# EAGLE design XYSunConnectors (EAGLE 9.6.2)
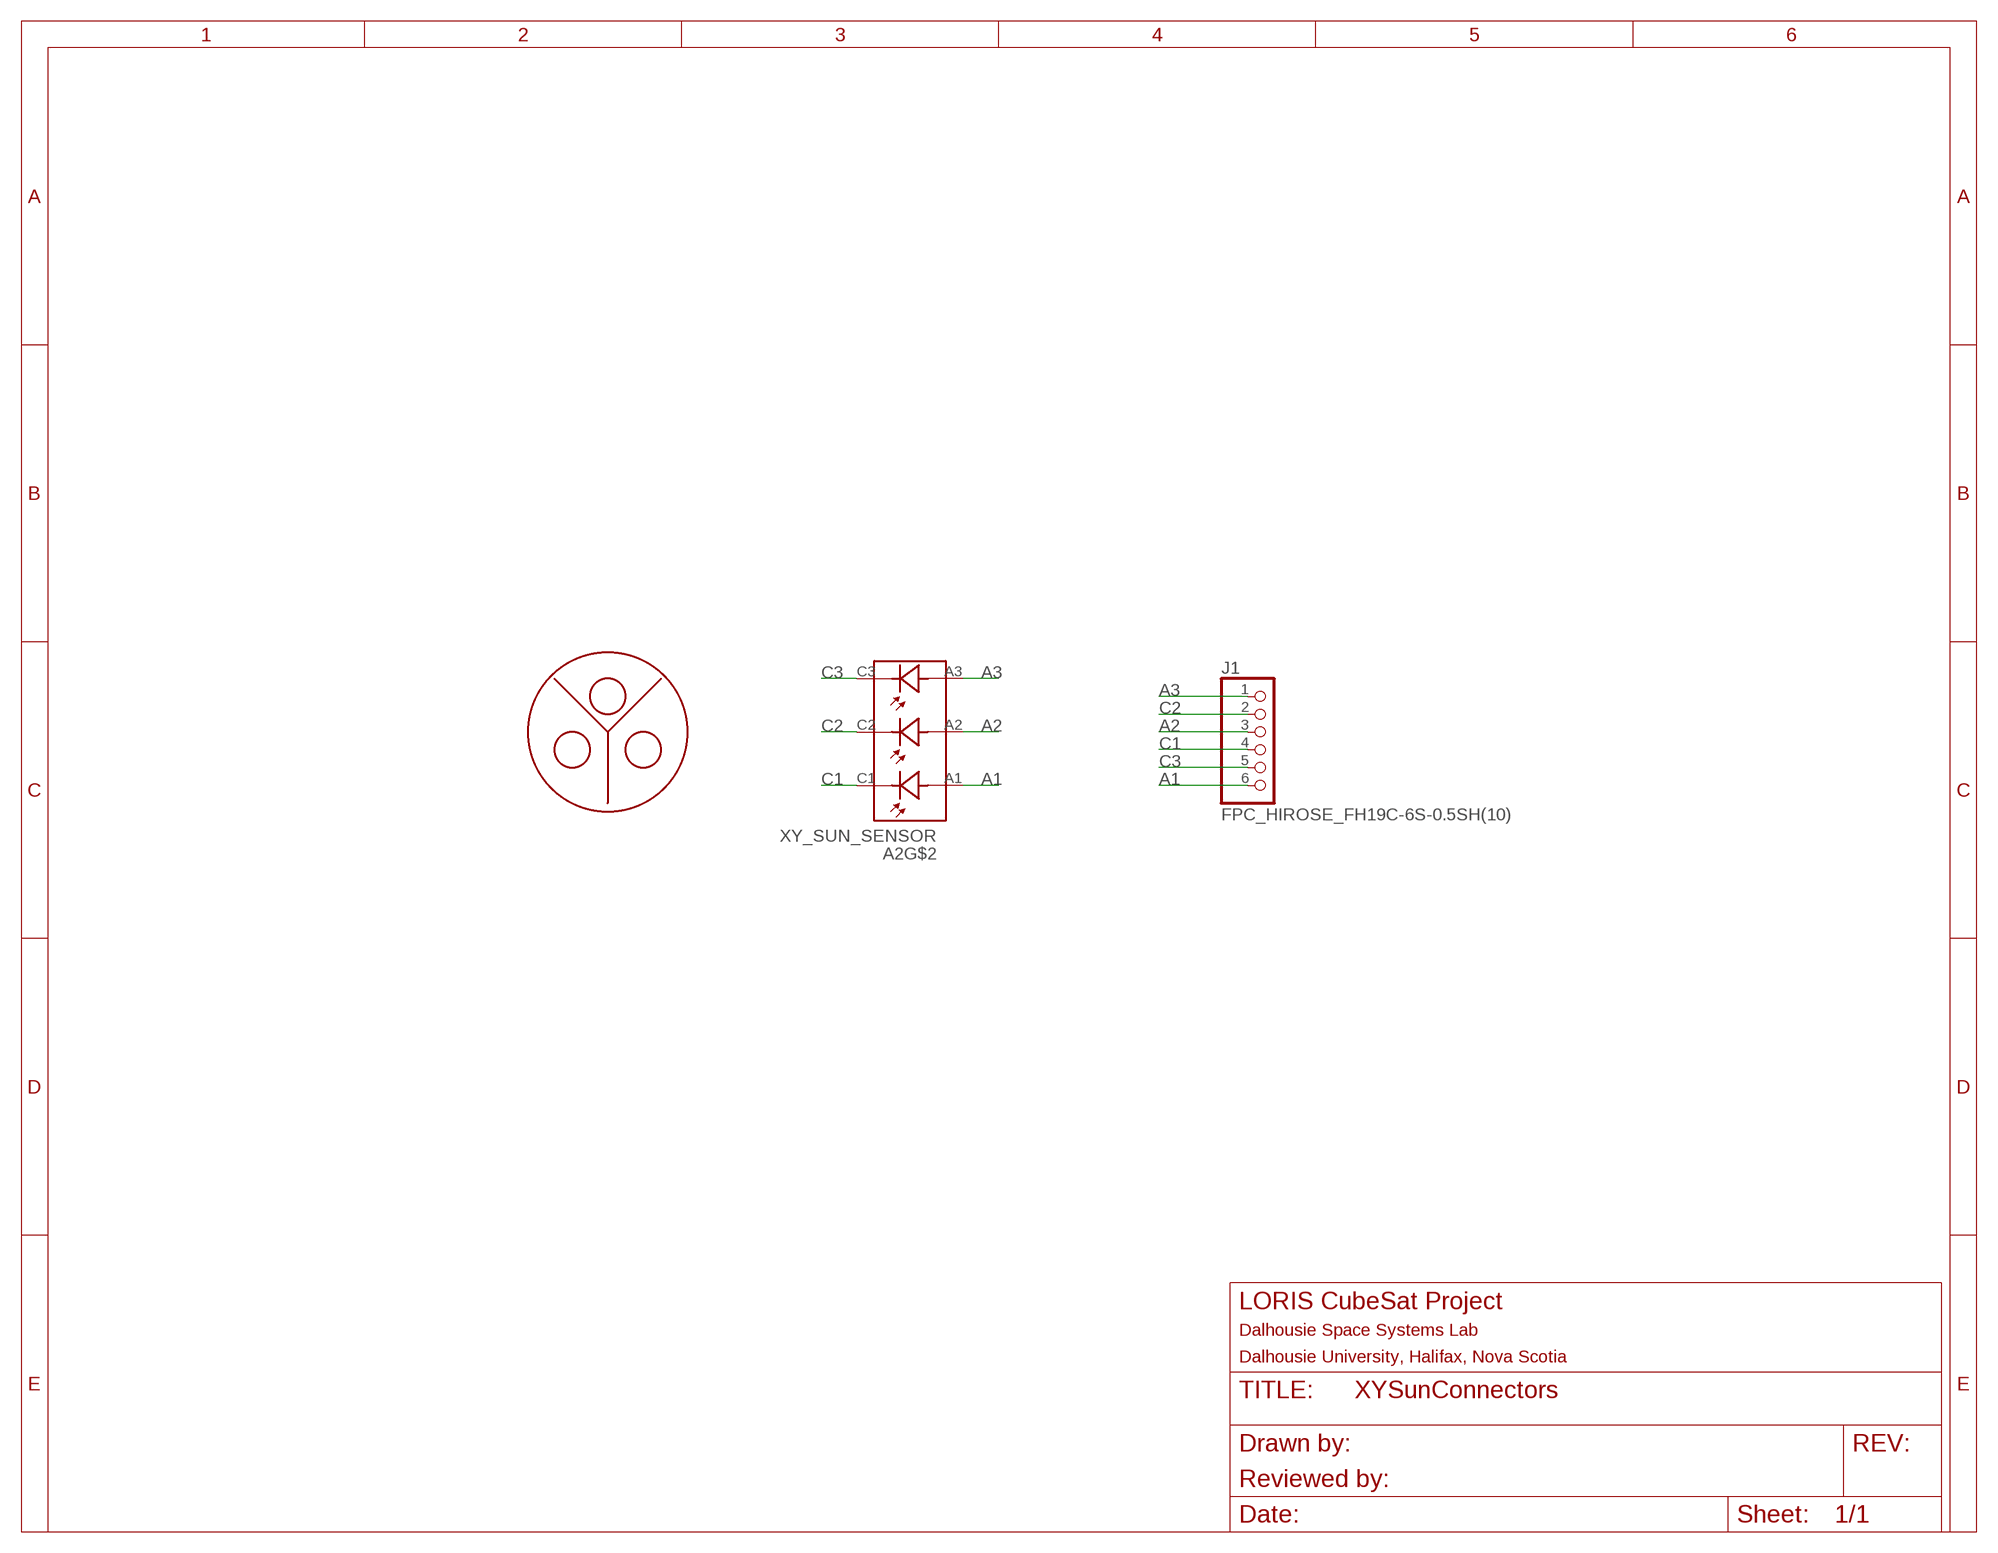
[diagram p0: schematic, sheet 1]

## Parts
A2  XY_SUN_SENSOR  [XY_SUN_SENOR_MASK]
J1  FPC_HIROSE_FH19C-6S-0.5SH(10)  [FPC_HIROSE_FH19C-6S-0.5SH(10)]

## Nets
A1: A2.A1 J1.6
A2: A2.A2 J1.3
A3: A2.A3 J1.1
C1: A2.C1 J1.4
C2: A2.C2 J1.2
C3: A2.C3 J1.5

## Library data of the parts
A2 = my_library:XY_SUN_SENSOR
J1 = my_library:FPC_HIROSE_FH19C-6S-0.5SH(10)

## Board
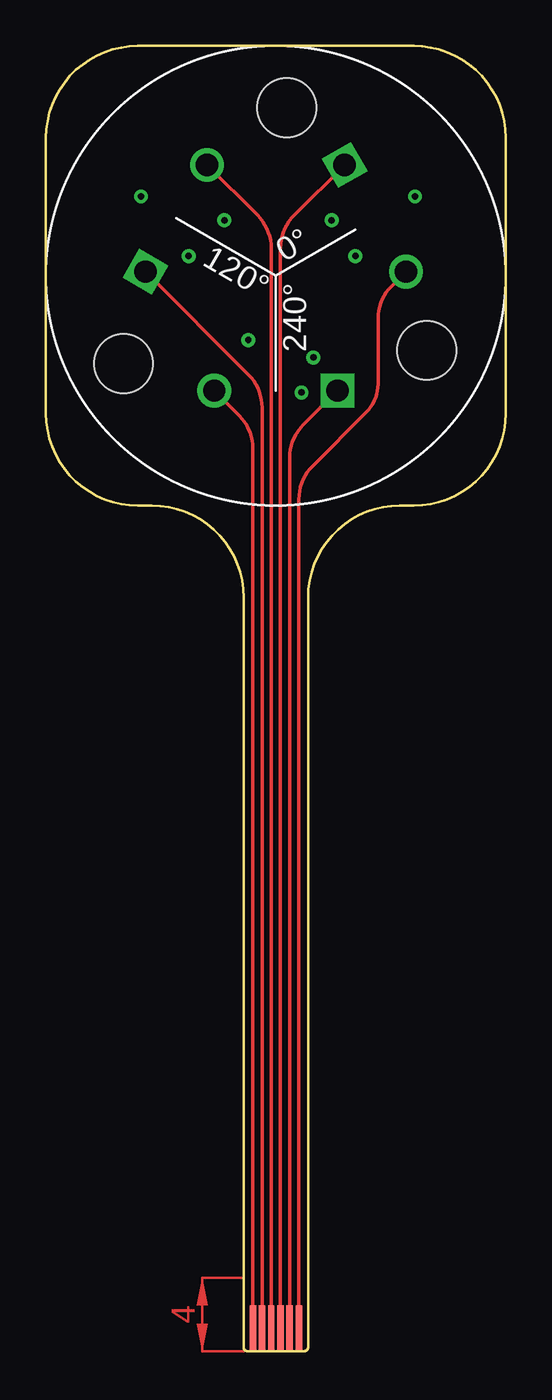
[diagram p1: board, top side]
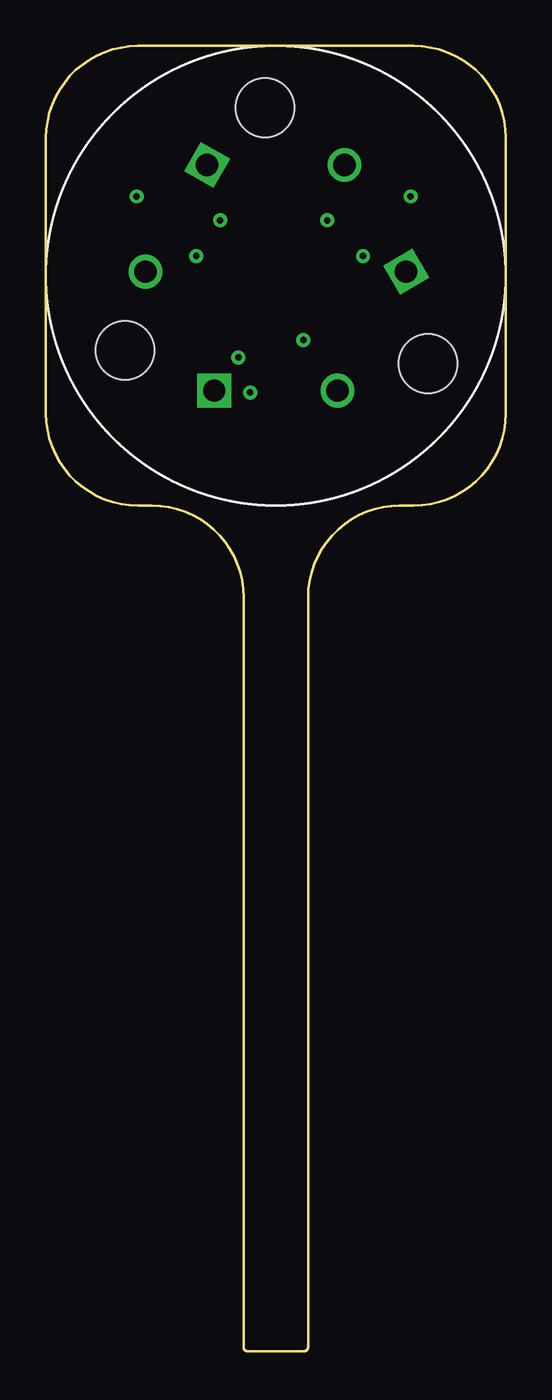
[diagram p2: board, bottom side, seen from below]

Size 25 x 71 mm. Coordinates in mm from the lower left corner, seen from the top.
Outline: 14.25,4 14.25,41 arc-90 19.25,46 20,46 arc90 25,51 25,66 arc90 20,71 5,71 arc90 0,66 0,51 arc90 5,46 5.75,46 arc-90 10.75,41 10.75,4
Copper layers (1*16): Top 0.035mm / dielectric 1.5mm / Bottom 0.035mm
Design rules "default *": minimum track width 6mil, minimum drill 0.35mm, track to track 6mil, track to pad 6mil, pad to pad 6mil, via to via 6mil, smd to smd 6mil, copper to edge 10mil, drill to drill 6mil, minimum pad ring 10mil, minimum via ring 8mil, stop-mask expansion 4mil, vias tented up to drill 0mil, thermal gap 10mil

### Footprints (pad centres in the part's own frame; a part is rotated, then mirrored left to right if it is on the bottom)
XY_SUN_SENOR_MASK = drill 1.219: A1 6.25,-3.35; A2 -0.224,7.088; A3 -6.026,-3.738 | drill 1.219 square: C1 6.25,3.35; C2 -6.026,3.738; C3 -0.224,-7.088 | hole 3.2: 5.08,-7.62; -9.56,0; 5.08,7.62
FPC_HIROSE_FH19C-6S-0.5SH(10) = smd 0.35 x 2.5: 1 1.25,1.25; 2 0.75,1.25; 3 0.25,1.25; 4 -0.25,1.25; 5 -0.75,1.25; 6 -1.25,1.25

### Placement (x,y rotation side)
A2  12.5,58.5 30 top
J1  12.5,2.5 180 top

### Tracks (layer width: path | path; a pad name or v marks a point on that pad's centre or on a via)
A1
  Top 0.203: J1.6 13.75,46.35 arc-45 14.49,48.15 17.42,51.08 arc45 18.06,52.61 18.06,56.16 arc-45 18.79,57.93 A2.A1
A2
  Top 0.203: A2.A2 11.51,61.78 arc-45 12.25,59.99 J1.3
A3
  Top 0.152: 11.25,2.18 J1.1
  Top 0.203: J1.1 11.25,49.1 arc45 10.51,50.89 A2.A3
C1
  Top 0.203: J1.4 12.75,59.99 arc-45 13.49,61.78 A2.C1
C2
  Top 0.203: J1.2 11.75,51.33 arc45 11.01,53.13 A2.C2
C3
  Top 0.203: J1.5 13.25,48.6 arc-45 13.99,50.39 A2.C3
N$7  (via drill 0.35)
  other vias: 5.17,62.81
N$8  (via drill 0.35)
  other vias: 9.7,61.52
N$9  (via drill 0.35)
  other vias: 7.76,59.58
N$10  (via drill 0.35)
  other vias: 15.53,61.52
N$11  (via drill 0.35)
  other vias: 16.83,59.58
N$12  (via drill 0.35)
  other vias: 20.07,62.81
N$13  (via drill 0.35)
  other vias: 13.89,52.15
N$14  (via drill 0.35)
  other vias: 11,55
N$15  (via drill 0.35)
  other vias: 14.54,54.05

### Text on the board
STIFFENER_PI: STIFFENER PI
STIFFENER_FR4: STIFFENER FR4